# Altium schematic sheet 1 Cover and Block Diagram.SchDoc: Cover
size B; DocumentNumber: 1; SheetNumber: 1; SheetTotal: 17
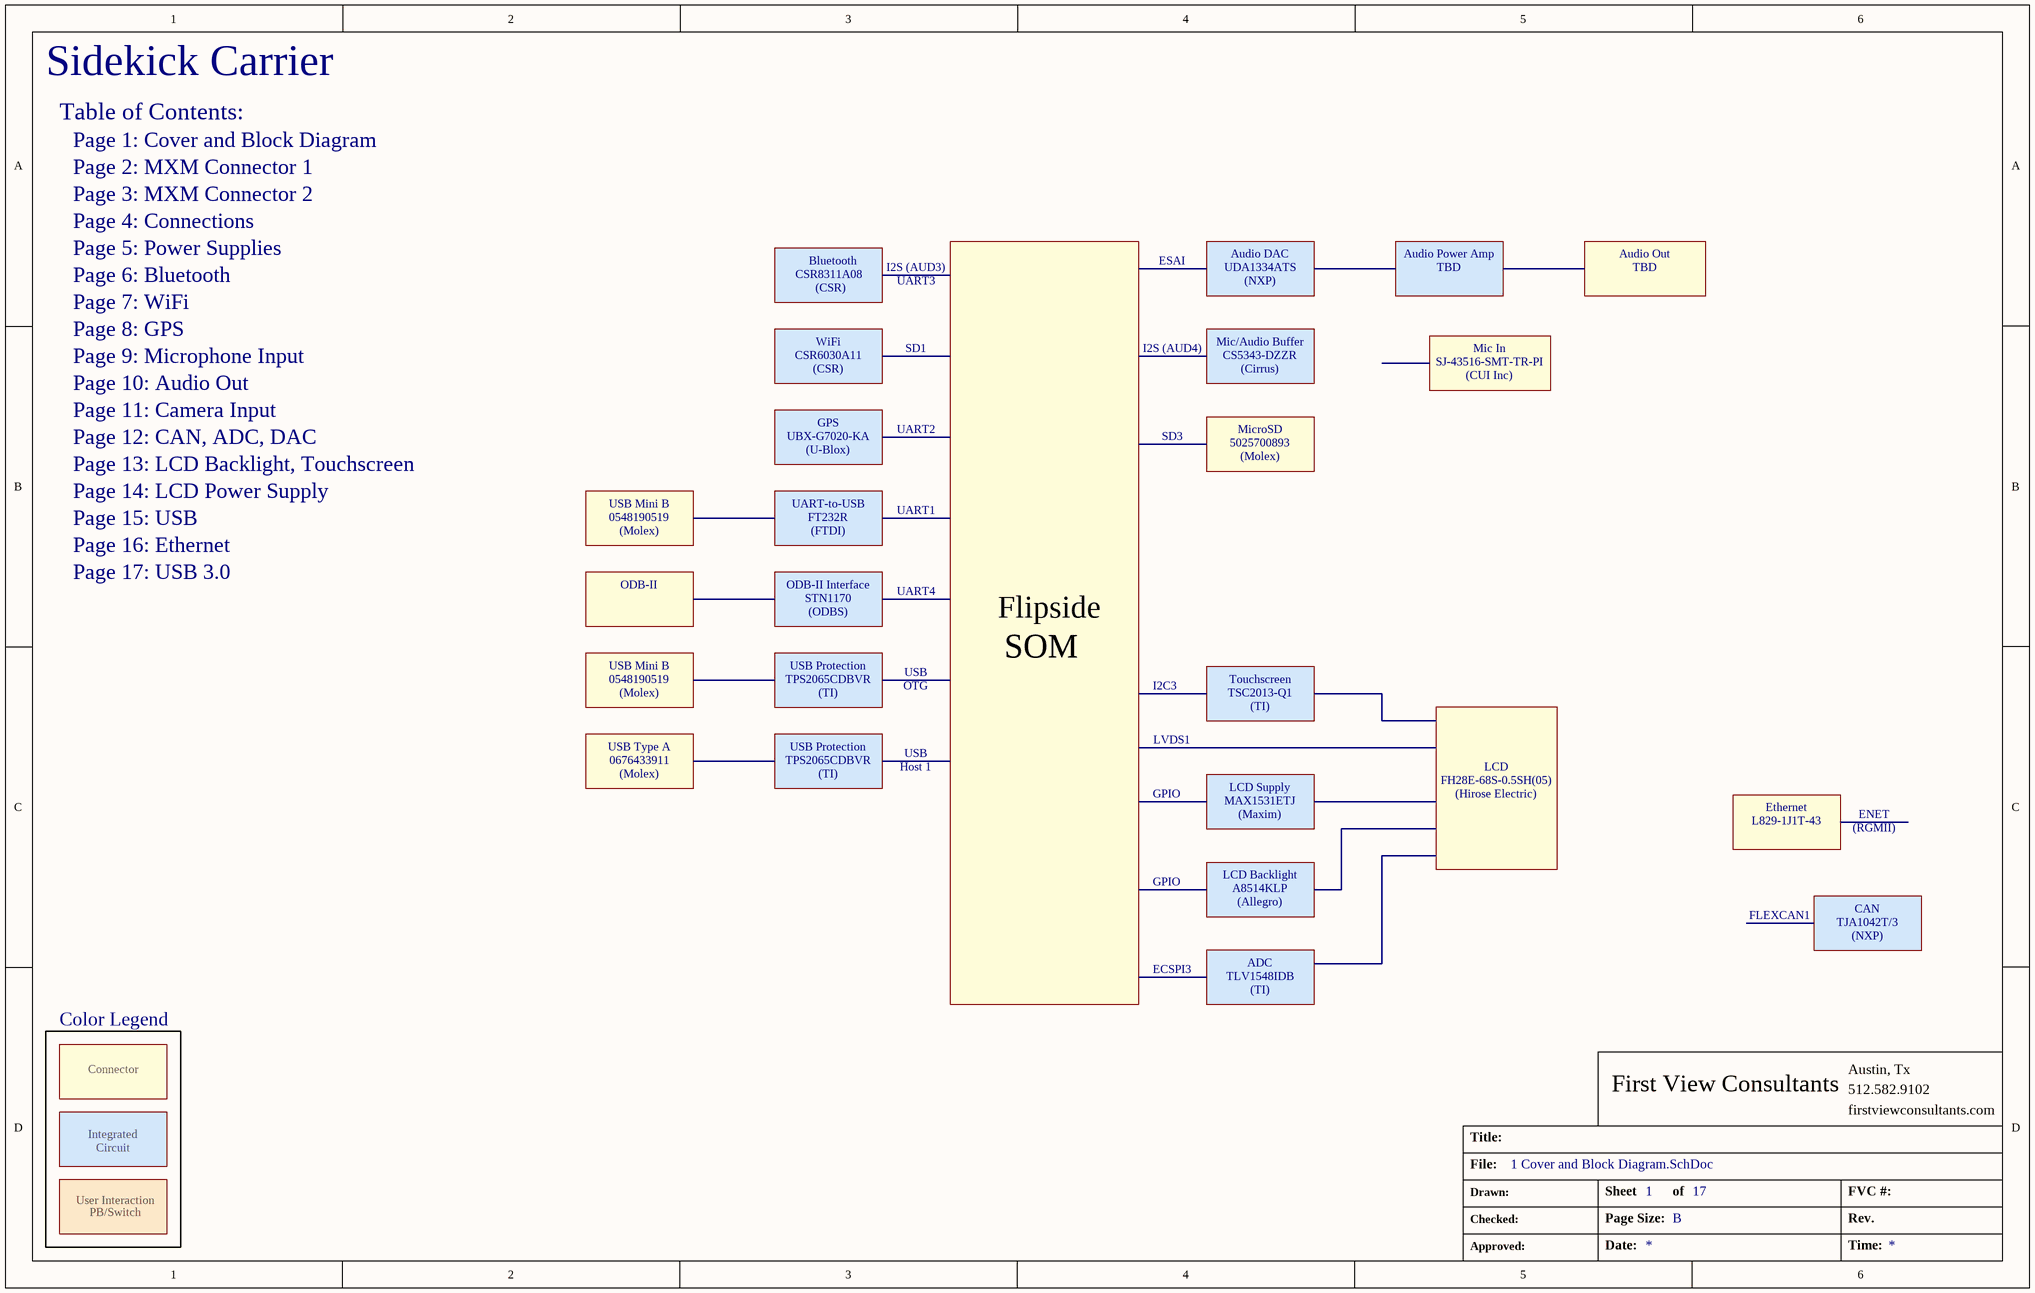
[diagram p0: 1 Cover and Block Diagram.SchDoc]

## Notes on the sheet
- Sidekick Carrier
- Table of Contents:
- Page 1: Cover and Block Diagram
- Page 2: MXM Connector 1
- Page 4: Connections
- Page 3: MXM Connector 2
- Page 5: Power Supplies
- Page 6: Bluetooth
- CSR8311A08
- Bluetooth
- (CSR)
- I2S (AUD3)
- UART3
- ESAI
- Audio DAC
- UDA1334ATS
- (NXP)
- Audio Power Amp
- TBD
- Audio Out
- Page 7: WiFi
- Page 8: GPS
- Page 9: Microphone Input
- WiFi
- CSR6030A11
- SD1
- I2S (AUD4)
- Mic/Audio Buffer
- CS5343-DZZR
- (Cirrus)
- Mic In
- SJ-43516-SMT-TR-PI
- Page 10: Audio Out
- Page 11: Camera Input
- GPS
- UART2
- MicroSD
- (CUI Inc)
- Page 12: CAN, ADC, DAC
- Page 13: LCD Backlight, Touchscreen
- Page 14: LCD Power Supply
- USB Mini B
- UBX-G7020-KA
- (U-Blox)
- UART-to-USB
- SD3
- 5025700893
- (Molex)
- Page 15: USB
- Page 16: Ethernet
- 0548190519
- FT232R
- (FTDI)
- UART1
- Page 17: USB 3.0
- ODB-II
- ODB-II Interface
- STN1170
- (ODBS)
- UART4
- Flipside
- USB Protection
- TPS2065CDBVR
- (TI)
- USB
- OTG
- SOM
- I2C3
- Touchscreen
- TSC2013-Q1
- USB Type A
- 0676433911
- Host 1
- LVDS1
- LCD
- GPIO
- LCD Supply
- MAX1531ETJ
- (Maxim)
- FH28E-68S-0.5SH(05)
- (Hirose Electric)
- Ethernet
- L829-1J1T-43
- ENET
- (RGMII)
- LCD Backlight
- A8514KLP
- (Allegro)
- CAN
- ECSPI3
- ADC
- FLEXCAN1
- TJA1042T/3
- Color Legend
- TLV1548IDB
- Connector
- Integrated
- Circuit
- User Interaction
- PB/Switch
- First View Consultants
- Austin, Tx
- 512.582.9102
- Title:
- File:
- firstviewconsultants.com
- Drawn:
- Checked:
- Sheet
- Page Size:
- of
- B
- FVC #:
- Rev.
- Approved:
- Date:
- Time: